# EAGLE design emonTx V3.2 (EAGLE 6.5.0)
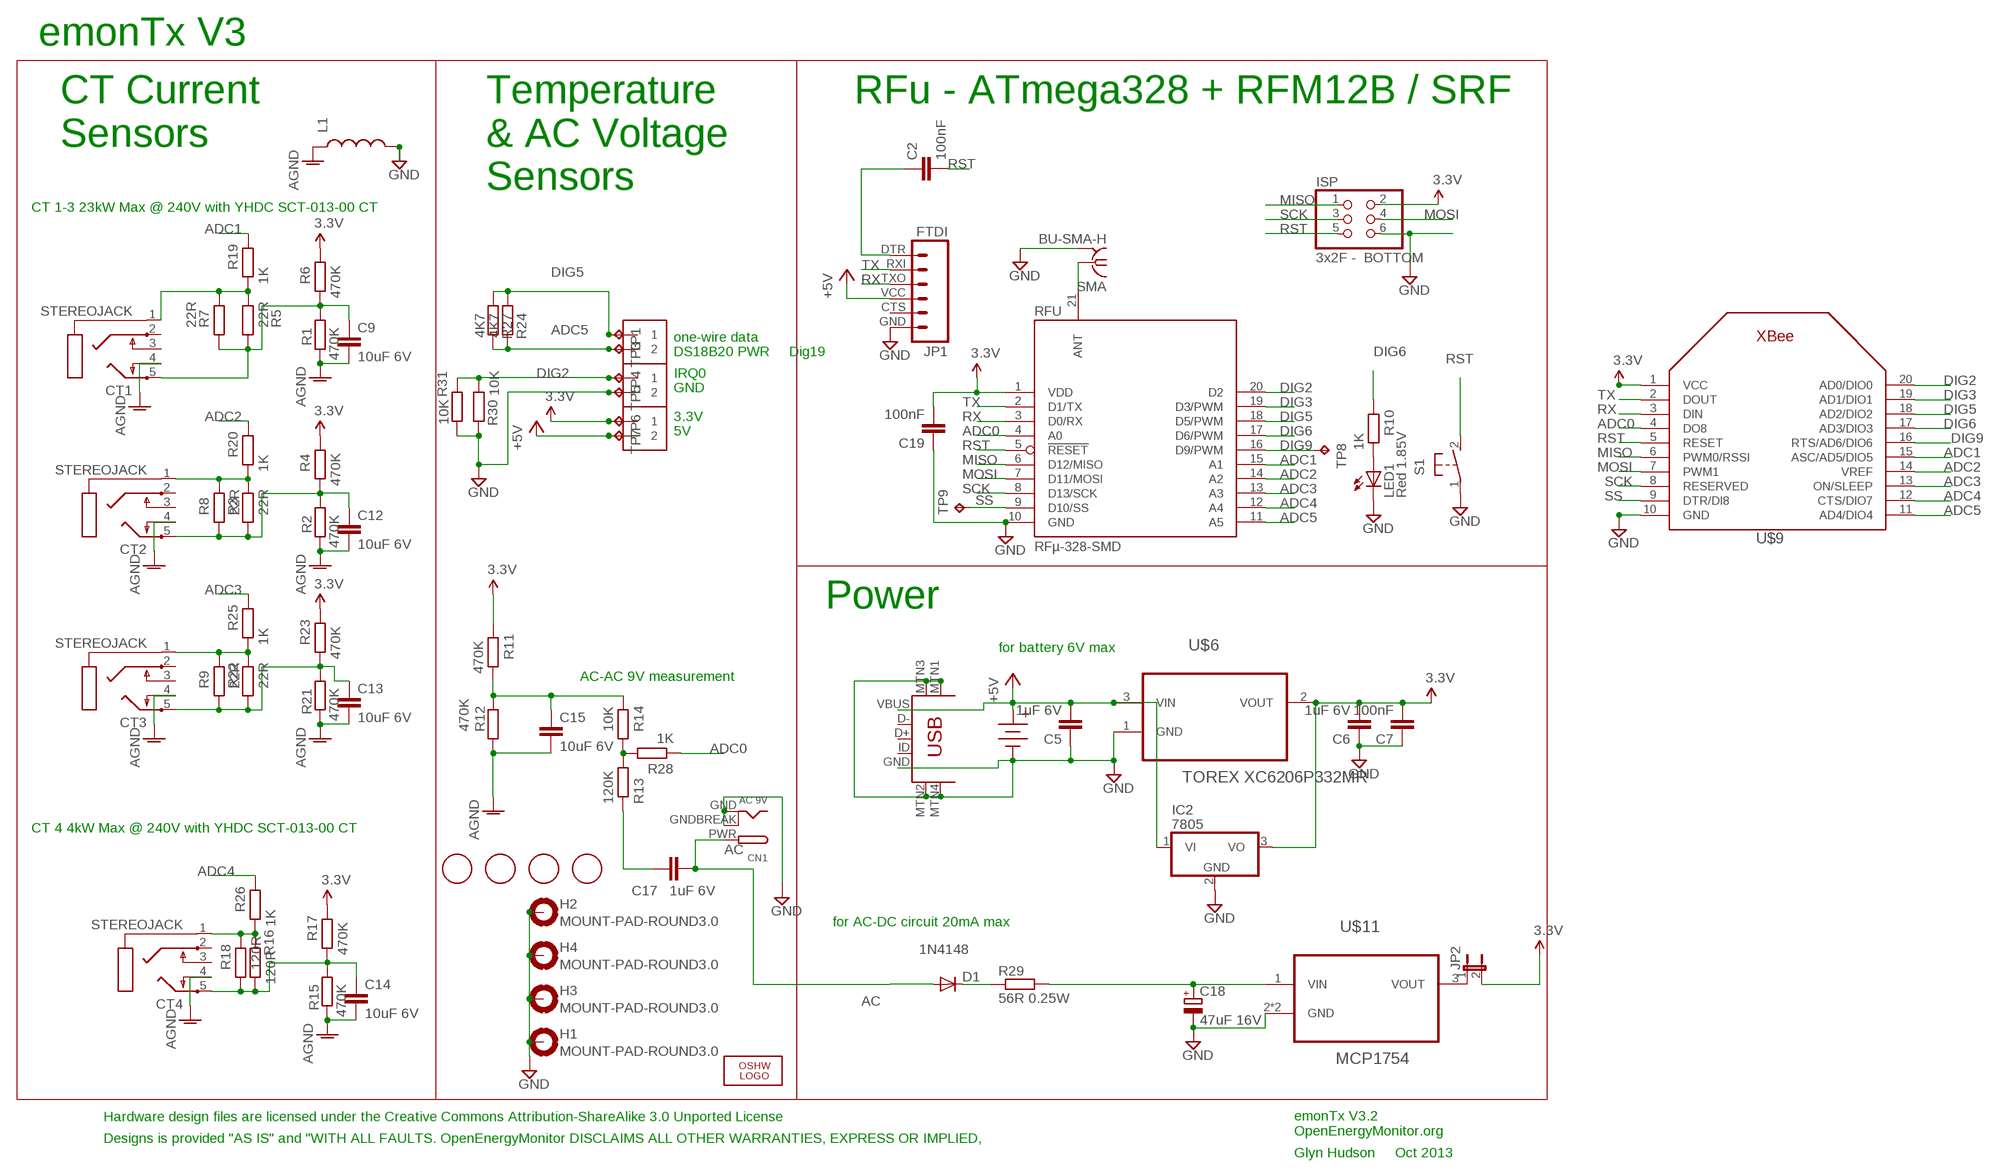
[diagram p0: schematic, sheet 1]

## Parts
C2  100nF  C-EUC0603  [C0603]
C5  1uF 6V  C-EUC0603  [C0603]
C6  1uF 6V  C-EUC0603  [C0603]
C7  100nF  C-EUC0603  [C0603]
C9  10uF 6V  C-EUC0603  [C0603]
C12  10uF 6V  C-EUC0603  [C0603]
C13  10uF 6V  C-EUC0603  [C0603]
C14  10uF 6V  C-EUC0603  [C0603]
C15  10uF 6V  C-EUC0603  [C0603]
C17  1uF 6V  C-EUC0603  [C0603]
C18  47uF 16V  CPOL-EUD  [PANASONIC_D]
C19  100nF  C-EUC0603  [C0603]
CN1  AC 9V  DCBARRELPTH  [DCJACK_2MM_PTH]
CT1  STEREOJACK  [STX3100]
CT2  STEREOJACK  [STX3100]
CT3  STEREOJACK  [STX3100]
CT4  STEREOJACK  [STX3100]
D1  1N4148  DIODESOD  [SOD-323]
H1  MOUNT-PAD-ROUND3.0  [3,0-PAD]
H2  MOUNT-PAD-ROUND3.0  [3,0-PAD]
H3  MOUNT-PAD-ROUND3.0  [3,0-PAD]
H4  MOUNT-PAD-ROUND3.0  [3,0-PAD]
IC2  7805  7812TV  [TO220V]
ISP  3x2F - BOTTOM  PINHD-2X3  [2X03]
J1  1X2-3.5MM  [1X2-3.5MM]
J2  1X2-3.5MM  [1X2-3.5MM]
J4  1X2-3.5MM  [1X2-3.5MM]
JP1  FTDI  FTDI_BASICPTH  [FTDI_BASIC]
JP2  JUMPER-2PTH_LOCK  [1X02_LOCK]
L1  INDUCTOR0603  [0603]
LED1  Red 1.85V  LEDCHIP-LED0805  [CHIP-LED0805]
LOGO1  OSHW_LOGO_6MILX0200-NT  [OSHW_6X200_NOTEXT]
R1  470K  R-EU_R0603  [R0603]
R2  470K  R-EU_R0603  [R0603]
R3  22R  R-EU_0204/7  [0204/7]
R4  470K  R-EU_R0603  [R0603]
R5  22R  R-EU_0204/7  [0204/7]
R6  470K  R-EU_R0603  [R0603]
R7  22R  R-EU_R1206  [R1206]
R8  22R  R-EU_R1206  [R1206]
R9  22R  R-EU_R1206  [R1206]
R10  1K  R-EU_R0603  [R0603]
R11  470K  R-EU_R0603  [R0603]
R12  470K  R-EU_R0603  [R0603]
R13  120K  R-EU_R0603  [R0603]
R14  10K  R-EU_R0603  [R0603]
R15  470K  R-EU_R0603  [R0603]
R16  120R  R-EU_0204/7  [0204/7]
R17  470K  R-EU_R0603  [R0603]
R18  120R  R-EU_R1206  [R1206]
R19  1K  R-EU_R0603  [R0603]
R20  1K  R-EU_R0603  [R0603]
R21  470K  R-EU_R0603  [R0603]
R22  22R  R-EU_0204/7  [0204/7]
R23  470K  R-EU_R0603  [R0603]
R24  4K7  R-EU_0204/7  [0204/7]
R25  1K  R-EU_R0603  [R0603]
R26  1K  R-EU_R0603  [R0603]
R27  4K7  R-EU_R0603  [R0603]
R28  1K  R-EU_R0603  [R0603]
R29  56R 0.25W  R-EU_R1206  [R1206]
R30  10K  R-EU_0204/7  [0204/7]
R31  10K  R-EU_R0603  [R0603]
RFU  RFµ-328-SMD  [RFµ-328-LANDING]
S1  31-XX  [B3F-31XX]
SMA  BU-SMA-H  [BU-SMA-H]
TP1  TPPAD1-13  [P1-13]
TP3  TPPAD1-13  [P1-13]
TP4  TPPAD1-13  [P1-13]
TP5  TPPAD1-13  [P1-13]
TP6  TPPAD1-13  [P1-13]
TP7  TPPAD1-13  [P1-13]
TP8  TPPAD1-13  [P1-13]
TP9  TPPAD1-13  [P1-13]
U$1  FIDUCIAL  [FIDUCIAL_1MM]
U$3  4.5V  3X_AAA_BATTERY_HOLDER  [AAA_PCB_HOLDER]
U$4  FIDUCIAL  [FIDUCIAL_1MM]
U$5  FIDUCIAL  [FIDUCIAL_1MM]
U$6  TOREX XC6206P332MR  MCP1700T-3302E/TT  [SOT95P237X112-3N]
U$7  FIDUCIAL  [FIDUCIAL_1MM]
U$9  XBEE  [XBEE]
U$10  USB-MINIB-5PIN  [USB-MINIB-CISECO]
U$11  MCP1754  [SOT89]

## Nets
3.3V: C6.2 C7.2 C19.2 IC2.3(VO) ISP.2 J4.1 JP2.2 R4.2 R6.2 R11.2 R17.2 R23.2 RFU.1(VDD) TP6.TP U$6.2(VOUT) U$9.1(VCC)
+5V [power]: C5.2 IC2.1(VI) J4.2 JP1.VCC TP7.TP U$3.+ U$6.3(VIN) U$10.VBUS
AC: C17.2 CN1.PWR D1.2(A)
ADC0: R28.1 RFU.4(A0) U$9.4(DO8)
ADC1: R19.2 RFU.15(A1) U$9.15(ASC/AD5/DIO5)
ADC2: R20.2 RFU.14(A2) U$9.14(VREF)
ADC3: R25.2 RFU.13(A3) U$9.13(ON/SLEEP)
ADC4: R26.2 RFU.12(A4) U$9.12(CTS/DIO7)
ADC5: J2.2 R24.2 R27.2 RFU.11(A5) TP3.TP U$9.11(AD4/DIO4)
AGND [gnd]: C9.2 C12.2 C13.2 C14.2 C15.2 CT1.4 CT2.4 CT3.4 CT4.4 L1.1 R1.2 R2.2 R12.1 R15.2 R21.2
DIG2: J1.1 R30.1 R31.1 RFU.20(D2) TP4.TP U$9.20(AD0/DIO0)
DIG3: RFU.19(D3/PWM) U$9.19(AD1/DIO1)
DIG5: J2.1 R24.1 R27.1 RFU.18(D5/PWM) TP1.TP U$9.18(AD2/DIO2)
DIG6: R10.2 RFU.17(D6/PWM) U$9.17(AD3/DIO3)
DIG9: RFU.16(D9/PWM) TP8.TP U$9.16(RTS/AD6/DIO6)
GND [gnd]: C5.1 C6.1 C7.1 C18.- C19.1 CN1.GND CN1.GNDBREAK H1.B3,0(MOUNT) H2.B3,0(MOUNT) H3.B3,0(MOUNT) H4.B3,0(MOUNT) IC2.2(GND) ISP.6 J1.2 JP1.GND L1.2 LED1.C R30.2 R31.2 RFU.10(GND) S1.1(P) SMA.2 SMA.3 SMA.4 SMA.5 TP5.TP U$3.- U$6.1(GND) U$9.10(GND) U$10.GND U$10.MTN1(MTN2) U$10.MTN2(MTN3) U$10.MTN3(MTN1) U$10.MTN4 U$11.2(GND) U$11.2.1(GND)
MISO: ISP.1 RFU.6(D12/MISO) U$9.6(PWM0/RSSI)
MOSI: ISP.4 RFU.7(D11/MOSI) U$9.7(PWM1)
N$2: CT1.1 R5.2 R7.2 R19.1
N$3: C13.1 CT3.5 R9.1 R21.1 R22.1 R23.1
N$4: R13.2 R14.1 R28.2
N$5: JP2.1 U$11.3(VOUT)
N$6: C18.+ R29.2 U$11.1(VIN)
N$7: C17.1 R13.1
N$8: CT4.1 R16.2 R18.2 R26.1
N$9: C2.1 JP1.DTR
N$10: CT2.1 R3.2 R8.2 R20.1
N$11: RFU.21(ANT) SMA.1
N$12: D1.1(C) R29.1
N$13: CT3.1 R9.2 R22.2 R25.1
N$33: C12.1 CT2.5 R2.1 R3.1 R4.1 R8.1
N$34: C15.1 R11.1 R12.2 R14.2
N$37: C14.1 CT4.5 R15.1 R16.1 R17.1 R18.1
N$38: C9.1 CT1.5 R1.1 R5.1 R6.1 R7.1
N$41: LED1.A R10.1
RST: C2.2 ISP.5 RFU.5(!RESET) S1.2(S) U$9.5(RESET)
RX: JP1.TXO RFU.3(D0/RX) U$9.3(DIN)
SCK: ISP.3 RFU.8(D13/SCK) U$9.8(RESERVED)
SS: RFU.9(D10/SS) TP9.TP U$9.9(DTR/DI8)
TX: JP1.RXI RFU.2(D1/TX) U$9.2(DOUT)
Unconnected: CT1.2 CT1.3 CT2.2 CT2.3 CT3.2 CT3.3 CT4.2 CT4.3 JP1.CTS U$10.D+ U$10.D- U$10.ID

## Notes on the sheet
- emonTx V3
- RFu - ATmega328 + RFM12B / SRF
- CT Current 
  Sensors
- Temperature 
  & AC Voltage
  Sensors
- CT 1-3 23kW Max @ 240V with YHDC SCT-013-00 CT
- one-wire data
- DS18B20 PWR | Dig19
- IRQ0
- GND
- 3.3V
- 5V
- Power
- for battery 6V max
- AC-AC 9V measurement
- CT 4 4kW Max @ 240V with YHDC SCT-013-00 CT
- for AC-DC circuit 20mA max
- Hardware design files are licensed under the Creative Commons Attribution-ShareAlike 3.0 Unported License
- emonTx V3.2
  OpenEnergyMonitor.org
- Designs is provided "AS IS" and "WITH ALL FAULTS. OpenEnergyMonitor DISCLAIMS ALL OTHER WARRANTIES, EXPRESS OR IMPLIED,
- Glyn Hudson     Oct 2013

## Library data of the parts
C2 C5-C7 C9 C12-C15 C17 C19 = resistor:C-EU: CAPACITOR, European symbol
C18 = resistor:CPOL-EU: POLARIZED CAPACITOR, European symbol
CN1 = adafruit:DCBARREL: 2.0mm DC Barrel Jack DCJACK_2MM_PTH - Through Hole Jack (4UConnector: 05537)
CT1-CT4 = adafruit:STEREOJACK: MIC/HEADPHONE JACK Stereo jack with two switches. Kycon STX3100, CUI SJ1-3555NG and/or 4UCon 05544
D1 = SparkFun:DIODE: Diode These are standard reverse protection diodes and small signal diodes. SMA package can handle up to about 1A. SOD-323 can handle about 200mA. What the SOD-323 package when ordering, there are some mfgs out there that are 5-pin packages.
H1-H4 = holes:MOUNT-PAD-ROUND: MOUNTING PAD, round
IC2 = linear:78*: Positive VOLTAGE REGULATOR Source: http://cache.national.com/ds/LM/LM78L05.pdf http://www.fairchildsemi.com/ds/LM/LM7805.pdf
ISP = pinhead:PINHD-2X3: PIN HEADER
J1 J2 J4 = adafruit:1X2: 3.5mm Terminal block http://www.ladyada.net/library/pcb/eaglelibrary.html
JP1 = SparkFun:FTDI_BASIC: FTDI Basic: 3.3V and 5V
JP2 = SparkFun:JUMPER-2: Jumper Basic 0.1" spaced jumper. Use with breakaway headers.
L1 = SparkFun:INDUCTOR: Inductors Basic Inductor/Choke - 0603 and 1206. Footprints are not proven and vary greatly between part numbers.
LED1 = adafruit:LED: LED OSRAM: - CHIPLED LG R971, LG N971, LY N971, LG Q971, LY Q971, LO R971, LY R971 LH N974, LH R974 LS Q976, LO Q976, LY Q976 LO Q996 - Hyper CHIPLED LW Q18S LB Q993, LB Q99A, LB R99A - SideLED LS A670, LO A670, LY A670, LG A670, LP A670 LB A673, LV A673, LT A673, LW A673 LH A674 LY A675 LS A676, LA A676, LO A676, LY A676, LW A676 LS A679, LY A679, LG A679 - Hyper Micro SIDELED® LS Y876, LA Y876, LO Y876, LY Y876 LT Y87S - SmartLED LW L88C, LW L88S LB L89C, LB L89S, LG L890 LS L89K, LO L89K, LY L89K LS L896, LA L896, LO L896, LY L896 - TOPLED LS T670, LO T670, LY T670, LG T670, LP T670 LSG T670, LSP T670, LSY T670, LOP T670, LYG T670 LG T671, LOG T671, LSG T671 LB T673, LV T673, LT T673, LW T673 LH T674 LS T676, LA T676, LO T676, LY T676, LB T676, LH T676, LSB T676, LW T676 LB T67C, LV T67C, LT T67C, LS T67K, LO T67K, LY T67K, LW E67C LS E67B, LA E67B, LO E67B, LY E67B, LB E67C, LV E67C, LT E67C LW T67C LS T679, LY T679, LG T679 LS T770, LO T770, LY T770, LG T770, LP T770 LB T773, LV T773, LT T773, LW T773 LH T774 LS E675, LA E675, LY E675, LS T675 LS T776, LA T776, LO T776, LY T776, LB T776 LHGB T686 LT T68C, LB T68C - Hyper Mini TOPLED® LB M676 - Mini TOPLED Santana® LG M470 LS M47K, LO M47K, LY M47K Source: http://www.osram.convergy.de/
LOGO1 = ohw-logo:OSHW_LOGO_6MIL
R1-R28 R30 R31 = rcl:R-EU_: RESISTOR, European symbol
R29 = resistor:R-EU_: RESISTOR, European symbol
RFU = Ciseco Footprints:RFµ-328-SMD
S1 = adafruit:31-XX: OMRON SWITCH Now with beefier pads!
SMA = con-coax:BU-SMA-H: FEMALE SMA CONNECTOR Radiall; OC_FARNELL: unknown; OC_NEWARK: unknown
TP1 TP3-TP9 = testpad:TP: Test pad
U$1 U$4 U$5 U$7 = adafruit:FIDUCIAL: For use by pick and place machines to calibrate the vision/machine, 1mm By microbuilder.eu
U$3 = Battery Holders:3X_AAA_BATTERY_HOLDER: 3x AA Battery Holder; RAPID_OC: 18-2967
U$6 = Farnell_MCP1700-SOT23:MCP1700T-3302E/TT: Low Quiescent Current LDO; MPN: MCP1700T-3302E/TT; OC_FARNELL: 1296592; OC_NEWARK: 88H9817; PACKAGE: SOT23-3; SUPPLIER: Microchip
U$9 = adafruit:XBEE
U$10 = Ciseco USB miniB:USB-MINIB: Mini-USB "B" connector with 5th pin broken out. Created new symbol breaking out 5th "ID" pin in mini/micro USB connector spec. See: http://en.wikipedia.org/wiki/Mini_usb#Cables. Uses same footprint as 4-pin symbol. Also added pins to connect to mounting / shield pads if required (probably not generally needed as signals aren't shielded once they leave the connector). Modified by Ciseco for Rapid Part 24-0357
U$11 = OpenEnergyMonitor:MCP1754

## Net classes
0 default: width 0.203 mm, drill 0.6 mm, clearance 0.203 mm
1 power: width 0.305 mm, drill 0.6 mm, clearance 0.254 mm
2 gnd: width 0.254 mm, drill 0.6 mm, clearance 0.254 mm

## Board
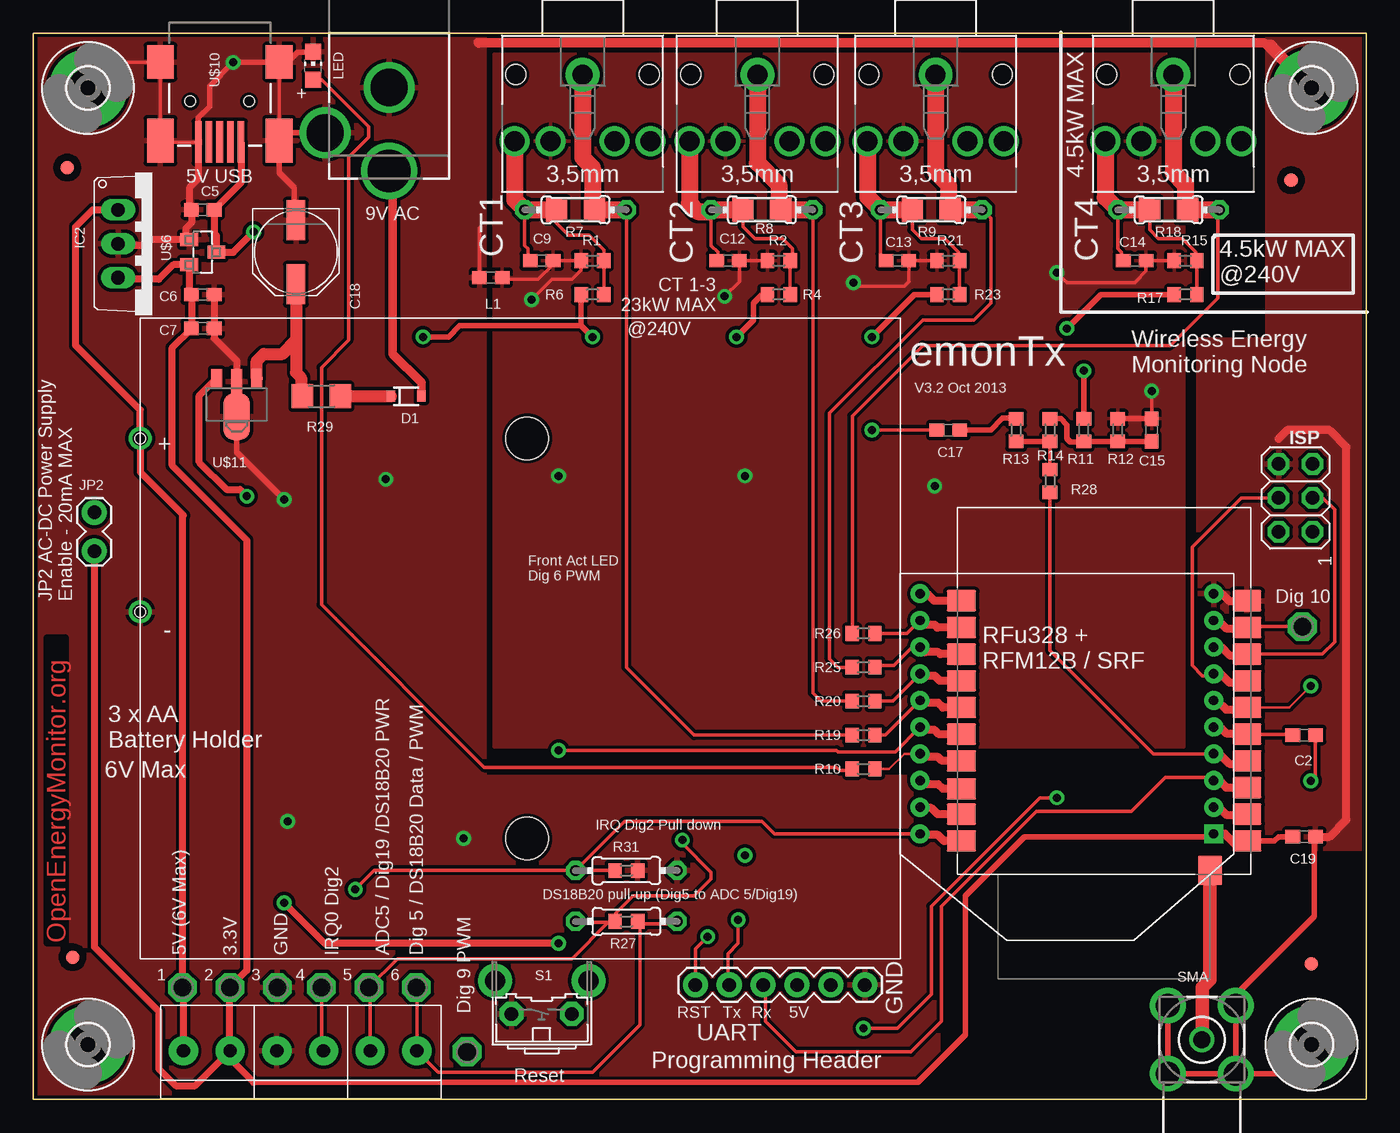
[diagram p1: board, top side]
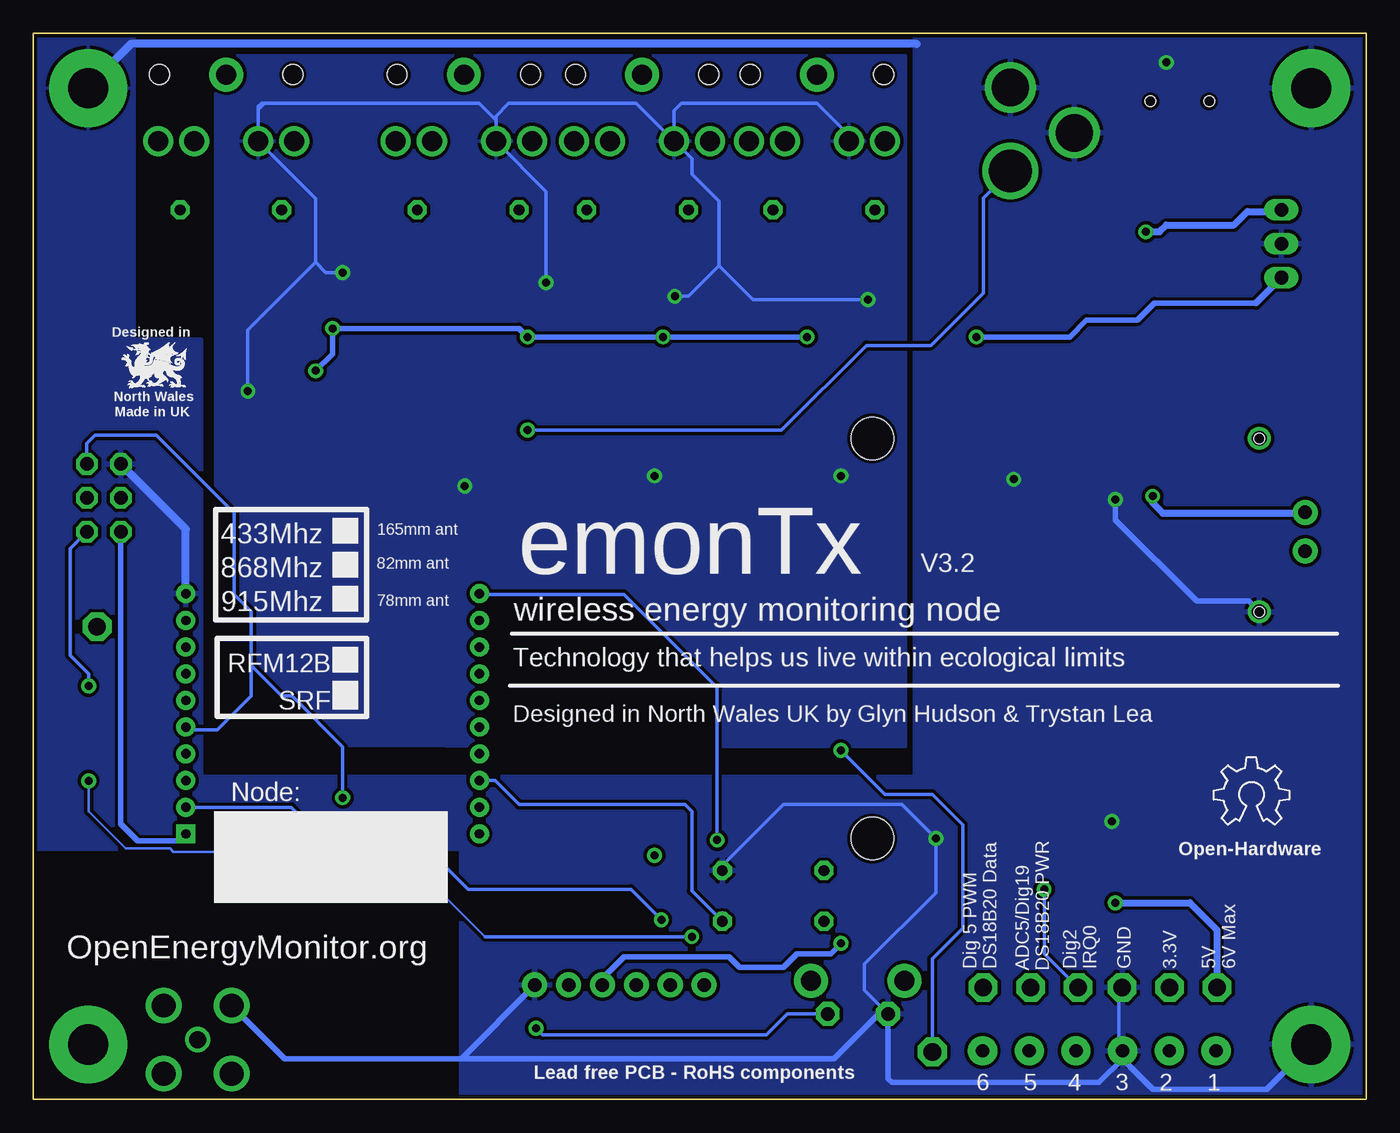
[diagram p2: board, bottom side, seen from below]

Size 99.9 x 79.9 mm. Coordinates in mm from the lower left corner, seen from the top.
Outline: 0,79.9 0,0 99.9,0 99.9,79.9 0,79.9
Copper layers (1*16): Top 0.035mm / dielectric 1.5mm / Bottom 0.035mm
Design rules "default *": minimum track width 8mil, minimum drill 0.6mm, track to track 8mil, track to pad 8mil, pad to pad 8mil, via to via 10mil, smd to smd 7mil, copper to edge 10mil, drill to drill 16mil, minimum pad ring 12mil, minimum via ring 10mil, stop-mask expansion 0.075mm, vias tented up to drill 0.6mm, thermal gap 10mil

### Footprints (pad centres in the part's own frame; a part is rotated, then mirrored left to right if it is on the bottom)
C0603 = smd 1.1 x 1: 1 -0.85,0; 2 0.85,0
PANASONIC_D = smd 3 x 1.4: + 2.4,0; - -2.4,0
DCJACK_2MM_PTH = drill 2.8: GND 0,7.35; GNDBREAK 4.8,10.75 | drill 3.2: PWR 0,13.6
STX3100 = drill 1.5 pad 2.54: 1 2.7,-0.1 | drill 1.5: 2 7.7,5; 3 7.7,2.3; 4 7.7,-2.5; 5 7.7,-5.2 | hole 1.5: 2.7,4.9; 2.7,-5.1
SOD-323 = smd 0.63 x 0.83: 1 -1.15,0; 2 1.15,0
3,0-PAD = drill 3 pad 5.842: B3,0 0,0
TO220V = drill 1.016 long: 1 -2.54,-2.54; 2 0,-2.54; 3 2.54,-2.54
2X03 = drill 1.016 octagon: 1 -2.54,-1.27; 2 -2.54,1.27; 3 0,-1.27; 4 0,1.27; 5 2.54,-1.27; 6 2.54,1.27
1X2-3.5MM = drill 1 pad 2.184: 1 1.8,0; 2 -1.7,0
FTDI_BASIC = drill 1.016 pad 1.88: CTS 10.16,0; DTR 0,0; GND 12.7,0; RXI 2.54,0; TXO 5.08,0; VCC 7.62,0
1X02_LOCK = drill 1.016 pad 1.88: 1 -0.178,0; 2 2.718,0
0603 = smd 1.1 x 1: 1 -0.85,0; 2 0.85,0
CHIP-LED0805 = smd 1.2 x 1.2: A 0,-1.05; C 0,1.05
R0603 = smd 1 x 1.1: 1 -0.85,0; 2 0.85,0
0204/7 = drill 0.813 octagon: 1 -3.81,0; 2 3.81,0
R1206 = smd 1.6 x 1.803: 1 -1.422,0; 2 1.422,0
RFµ-328-LANDING = smd 2.2 x 1.6: 1 -10.7,20; 2 -10.7,18; 3 -10.7,16; 4 -10.7,14; 5 -10.7,12; 6 -10.7,10; 7 -10.7,8; 8 -10.7,6; 9 -10.7,4; 10 -10.7,2; 11 10.7,2; 12 10.7,4; 13 10.7,6; 14 10.7,8; 15 10.7,10; 16 10.7,12; 17 10.7,14; 18 10.7,16.1; 19 10.7,18; 20 10.7,20 | smd 1.8 x 2.2: 21 -7.93,22.2
B3F-31XX = drill 1.016 pad 1.778 octagon: 1 -2.261,-1.245; 2 2.261,-1.245 | drill 1.499 pad 2.54: 3 -3.505,1.245; 4 3.505,1.245
BU-SMA-H = drill 1.27: 1 0,0 | drill 1.778: 2 -2.55,2.55; 3 2.55,2.55; 4 2.55,-2.55; 5 -2.55,-2.55
P1-13 = drill 1.321 pad 2.159 octagon: TP 0,0
FIDUCIAL_1MM = smd 1 x 1: 1 0,0
AAA_PCB_HOLDER = drill 1.1: + 29,-15; - 29,-2 | hole 0.8: 29,-15; 29,-2 | hole 3.2: 0,15; 0,-15
SOT95P237X112-3N = smd 0.991 x 1.321: 1 -0.94,-1.016; 2 0.94,-1.016; 3 0,1.016
XBEE = drill 0.7 pad 1.422 square: 1 -11,5.5 | drill 0.7 pad 1.422: 2 -11,3.5; 3 -11,1.5; 4 -11,-0.5; 5 -11,-2.5; 6 -11,-4.5; 7 -11,-6.5; 8 -11,-8.5; 9 -11,-10.5; 10 -11,-12.5; 11 11,-12.5; 12 11,-10.5; 13 11,-8.5; 14 11,-6.5; 15 11,-4.5; 16 11,-2.5; 17 11,-0.5; 18 11,1.5; 19 11,3.5; 20 11,5.5
USB-MINIB-CISECO = smd 3.1 x 0.5: D+ 8.25,0; D- 8.25,0.8; GND 8.25,-1.6; ID 8.25,-0.8; VBUS 8.25,1.6 | smd 2.5 x 2: MTN1 2.25,4.45; MTN3 2.25,-4.45 | smd 3.3 x 2: MTN2 8.15,4.45; MTN4 8.15,-4.45 | hole 0.8: 5.2,2.2; 5.2,-2.2
SOT89 = smd 0.8 x 1.4: 1 -1.499,-1.981; 3 1.499,-1.981 | smd 0.8 x 1.9: 2 0,-1.727 | smd 2 x 3.5: 2.1 0,0.889

### Placement (x,y rotation side)
C2  95.25,27.3 180 top
C5  12.7,66.67 0 top
C6  12.7,60.32 180 top
C7  12.7,57.78 180 top
C9  38.1,62.86 0 top
C12  52.07,62.86 0 top
C13  64.77,62.86 0 top
C14  82.55,62.86 0 top
C15  83.82,50.16 90 top
C17  68.58,50.16 180 top
C18  19.68,63.49 270 top
C19  95.25,19.68 180 top
CN1  26.67,83.19 180 top
CT1  41.27,79.51 270 top
CT2  54.37,79.51 270 top
CT3  67.73,79.51 270 top
CT4  85.54,79.51 270 top
D1  27.94,52.7 0 top
H1  4.1,75.8 0 top
H2  95.8,75.8 0 top
H3  4.1,4.1 0 top
H4  95.8,4.1 0 top
IC2  8.89,64.13 270 top
ISP  94.61,45.08 90 top
J1  19.95,3.63 0 top
J2  26.95,3.63 0 top
J4  12.95,3.63 0 top
JP1  49.62,8.57 0 top
JP2  4.57,43.81 270 top
L1  34.29,61.59 180 top
LED1  20.95,77.46 0 top
LOGO1  11.43,20.57 0 bottom
R1  41.91,62.86 180 top
R2  55.88,62.86 180 top
R3  54.61,66.67 0 top
R4  55.88,60.32 180 top
R5  40.64,66.67 0 top
R6  41.91,60.32 180 top
R7  40.64,66.67 0 top
R8  54.61,66.67 0 top
R9  67.31,66.67 0 top
R10  62.23,24.76 0 top
R11  78.74,50.16 90 top
R12  81.28,50.16 270 top
R13  73.66,50.16 270 top
R14  76.2,50.16 90 top
R15  86.36,62.86 180 top
R16  85.09,66.67 0 top
R17  86.36,60.32 180 top
R18  85.09,66.67 0 top
R19  62.23,27.3 0 top
R20  62.23,29.84 0 top
R21  68.58,62.86 180 top
R22  67.31,66.67 0 top
R23  68.58,60.32 180 top
R24  44.45,13.33 180 top
R25  62.23,32.38 0 top
R26  62.23,34.92 0 top
R27  44.45,13.33 180 top
R28  76.2,46.35 90 top
R29  21.59,52.7 180 top
R30  44.45,17.14 0 top
R31  44.45,17.14 0 top
RFU  80.26,39.36 180 top
S1  38.1,7.64 0 top
SMA  87.58,4.46 270 top
TP1  28.7,8.38 0 top
TP3  25.15,8.38 0 top
TP4  21.59,8.38 0 top
TP5  18.29,8.38 0 top
TP6  14.73,8.38 0 top
TP7  11.18,8.38 0 top
TP8  32.51,3.55 0 top
TP9  95.12,35.43 0 top
U$1  95.79,10.15 0 top
U$3  37.01,34.54 180 top
U$4  2.94,10.65 0 top
U$5  94.27,68.9 0 top
U$6  12.7,63.49 270 top
U$7  2.54,69.84 0 top
U$9  77.47,25.39 180 top
U$10  13.97,80 270 top
U$11  15.24,52.06 180 top

### Tracks (layer width: path | path; a pad name or v marks a point on that pad's centre or on a via)
3.3V  (via drill 0.6)
  Top 0.406: 90.17,19.04 90.64,19.04 RFU.1 93.03,19.36 93.34,19.68 C19.2 | R6.2 41.06,57.99 | 41.06,57.99 v41.91,57.14 | v52.7,57.14 53.98,58.41 53.98,59.68 54.61,60.32 R4.2 | R23.2 66.04,60.32 v62.87,57.14 | R17.2 80.01,60.32 v77.47,57.78 | 6.48,61.46 IC2.3 | 11.68,60.49 C6.2 | v78.74,54.6 R11.2 | J4.1 14.75,3.02 | 16.51,1.26 66.29,1.26 69.85,4.82 69.85,15.23 74.3,19.68 88.25,19.68 U$9.1 | 41.06,57.99 31.96,57.99 31.11,57.14 v29.21,57.14
  Top 0.508: 6.48,61.46 9.4,61.46 10.49,62.55 U$6.2 11.68,60.49 | C6.2 C7.2 10.41,56.34 10.41,47.49 16,41.9 16,9.65 TP6.TP 14.73,3.65 J4.1 12.13,1.01 10.67,1.01 9.4,2.28 9.4,6.6 4.57,11.42 JP2.2 | 14.75,3.02 16.51,1.26
  Top 0.61: 90.17,19.04 89.32,19.89 U$9.1
  Bottom 0.406: U$9.1 89,19.36 92.08,19.36 93.34,20.63 ISP.2 | v41.91,57.14 v52.7,57.14 v62.87,57.14 63.5,57.78 v77.47,57.78 77.47,55.87 v78.74,54.6 | v29.21,57.14 22.23,57.14 20.95,58.41 17.14,58.41 15.88,59.68 8.26,59.68
  Bottom 0.508: 8.26,59.68 IC2.3
+5V  (via drill 0.6)
  Top 0.406: IC2.1
  Top 0.508: U$10.VBUS 15.57,68.69 C5.2 13.55,64.93 13.72,64.76 U$6.3 14.99,63.49 v16.51,65.02 | IC2.1 4.45,66.67 3.17,65.4 3.17,56.51 8.01,51.67 U$3.+ 8.01,47 11.25,43.76 11.18,43.69 TP7.TP 11.25,8.3 | J4.2 11.25,8.3 | 11.25,8.3 11.25,8.7 | v39.37,11.68 21.84,11.68 v18.8,14.73
  Bottom 0.406: 6.48,66.54 IC2.1 | v39.37,11.68 40.13,10.92 42.67,10.92 43.69,9.9 46.99,9.9 47.75,10.66 55.63,10.66 57.24,9.05 JP1.VCC
  Bottom 0.508: v16.51,65.02 15.49,65.02 14.99,65.53 9.91,65.53 8.89,66.54 6.48,66.54 | v18.8,14.73 13.21,14.73 11.18,12.69 TP7.TP
AC  (via drill 0.6)
  Top 0.254: C17.2 v62.87,50.16
  Top 0.635: D1.2 29.09,53.71 26.92,55.87 26.92,69.34 CN1.PWR
  Bottom 0.254: v62.87,50.16 43.81,50.16 37.47,56.51 32.64,56.51 28.7,60.45 28.7,67.56 CN1.PWR
ADC0
  Top 0.254: R28.1 76.2,33.65 83.95,25.89 U$9.4
  Top 0.61: U$9.4 88.91,25.89 89.66,25.14 90.49,25.14 RFU.4
ADC1
  Top 0.254: 66.65,29.71 U$9.15 63.88,27.3 R19.2
  Top 0.61: RFU.15 68.17,29.36 67.82,29.71 66.65,29.71
ADC2
  Top 0.254: 66.62,31.74 U$9.14 64.42,29.84 R20.2
  Top 0.61: RFU.14 67.94,31.36 67.56,31.74 66.62,31.74
ADC3
  Top 0.254: 67.98,33.36 67.82,33.52 | U$9.13 65.9,33.89 64.52,32.51 63.2,32.51 R25.2
  Top 0.61: RFU.13 67.98,33.36 | 67.82,33.52 66.84,33.52 U$9.13
ADC4
  Top 0.254: R26.2 65.5,34.92 U$9.12
  Top 0.61: RFU.12 67.75,35.36 67.56,35.55 66.81,35.55 U$9.12
ADC5  (via drill 0.6)
  Top 0.254: 66.52,37.84 U$9.11 | v48.64,19.42 48.64,19.17 50.8,17.01 50.8,16.5 49.53,15.23 44.96,15.23 43.69,13.96 43.69,13.24 | 25.48,3.63 J2.2 25.25,8.27 TP3.TP 27.3,10.53 40.39,10.53 43.09,13.24 | 43.69,13.24 R27.2 | 43.09,13.24 40.73,13.24 R24.2 | 43.69,13.24 43.09,13.24
  Top 0.61: RFU.11 67.53,37.36 67.06,37.84 66.52,37.84
  Bottom 0.254: U$9.11 66.42,37.84 55.63,37.84 48.9,31.11 48.77,30.98 48.64,30.85 v48.64,19.42
AGND  (via drill 0.6)
  Top 0.254: C15.2 v83.82,53.08 | R15.2 C14.2 83.4,62.06 82.55,61.21 77.47,61.21 v76.71,61.97 | R2.2 C12.2 52.92,61.3 v51.82,60.19 | R21.2 C13.2 65.62,61.3 65.28,60.95 61.72,60.95 v61.47,61.21 | L1.1 35.27,61.46 37.85,61.46 38.95,62.57 C9.2 R1.2 41.06,62.14 40.39,61.46 38.86,61.46 v37.34,59.94
  Top 0.406: R12.1 C15.2
  Bottom 0.254: CT2.4 51.87,74.11 51.31,74.67 41.15,74.67 38.86,72.38 38.86,71.9 CT1.4 | 65.23,73.4 CT3.4 61.47,68.05 v61.47,61.21 | 65.23,73.4 65.23,73.7 64.26,74.67 54.72,74.67 CT2.4 | CT4.4 83.04,74.43 82.8,74.67 82.55,74.67 | 82.55,74.67 66.5,74.67 65.23,73.4 | CT4.4 83.04,74.18 82.55,74.67 | v51.82,60.19 50.8,60.19 48.51,62.48 | 48.51,62.48 48.51,67.3 50.55,69.34 50.55,70.49 CT2.4 | v83.82,53.08 83.82,57.65 78.74,62.73 | 78.74,62.73 78.74,67.51 CT4.4 | v76.71,61.97 77.98,61.97 78.74,62.73 | v37.34,59.94 45.97,59.94 48.51,62.48
  other vias: 53.34,46.73 39.37,46.73 67.56,45.97
  pour Top (isolate 0): 34.54,78.35 34.54,26.41 86.23,26.41 86.23,78.35
  pour Bottom (isolate 0): 34.54,26.41 86.23,26.54 86.23,78.23 34.54,78.23
  pour Top: 84.84,78.35 91.44,78.35 91.44,58.79 84.84,58.79
  pour Top: 84.07,78.35 91.31,78.35 91.31,58.79 84.07,58.79
DIG2  (via drill 0.6)
  Top 0.254: 66.56,19.81 U$9.20 55.54,19.89 54.61,20.82 44.32,20.82 R30.1 | R31.1 R30.1 | R30.1 25.53,17.14 v24.13,15.74 | TP4.TP 21.59,3.79 J1.1
  Top 0.61: RFU.20 68.26,19.36 67.82,19.81 66.56,19.81
  Bottom 0.254: v24.13,15.74 24.13,10.92 TP4.TP
DIG3
  Top 0.254: 66.53,21.84 U$9.19
  Top 0.61: RFU.19 67.78,21.36 67.31,21.84 66.53,21.84
DIG5
  Top 0.254: 45.47,13.16 45.47,5.58 41.91,2.03 30.36,2.03 J2.1 28.75,8.33 TP1.TP | 45.47,13.16 R27.1 | 45.47,13.16 48.09,13.16 R24.1
  Top 0.61: RFU.18 68.17,23.26 67.82,23.62 66.75,23.62 U$9.18
  Bottom 0.254: U$9.18 65.3,23.89 63.5,22.09 51.05,22.09 50.55,21.58 50.55,15.62 R24.1 48.26,13.96
DIG6
  Top 0.203: R10.2 64.14,24.76 65.28,25.9 U$9.17
  Top 0.254: 66.72,25.65 U$9.17
  Top 0.61: RFU.17 68.1,25.36 67.82,25.65 66.72,25.65
DIG9  (via drill 0.6)
  Top 0.254: 66.68,27.68 U$9.16 64.61,26.03 60.33,26.03 60.2,26.16 v39.37,26.16
  Top 0.61: RFU.16 67.88,27.36 67.56,27.68 66.68,27.68
  Bottom 0.254: v39.37,26.16 36.07,22.85 32.51,22.85 30.23,20.57 30.23,12.82 32.51,10.53 TP8.TP
GND  (via drill 0.6)
  Top 0.203: 96.01,19.59 C19.1 | 18.29,3.67 J1.2
  Top 0.254: 90.68,37.33 RFU.10 | U$10.MTN2 18.42,77.09 18.54,77.21 18.54,77.63 U$10.MTN1 | U$10.MTN4 U$10.MTN3 6.05,77.75 H1.B3,0 | U$10.MTN4 9.52,71.25 9.65,71.11 | 9.65,71.11 9.65,70.86 | 9.65,71.11 9.65,71.72 U$10.MTN4 | U$10.GND 9.62,71.75 U$10.MTN4 | L1.2 33.44,65.33 | U$11.2.1 15.24,50.29
  Top 0.305: 95.01,75.8 95.9,75.8
  Top 0.406: 11.68,66.84 C5.1 | 11.43,64.69 U$6.1 | 6.48,64 IC2.2 | 96.01,19.59 96.01,13.71 90.13,7.83 SMA.2 SMA.3 | SMA.3 93.61,1.91 H4.B3,0 | SMA.3 SMA.4 SMA.5 | 18.54,77.63 18.96,77.63 19.81,78.48 20.92,78.48 LED1.C | C18.- 19.56,66.02 19.56,68.32 18.42,69.46 U$10.MTN2 19.01,72.44 CN1.GNDBREAK | U$10.GND 12.37,73.58 13.21,74.42 13.21,75.94 v14.99,77.72 18.38,77.72 U$10.MTN1 | 15.24,50.29 15.24,48.51 v18.8,44.95
  Top 0.508: U$10.GND 12.37,69.01 11.68,68.32 11.68,66.84 | C5.1 11.85,65.69 11.43,65.27 11.43,64.69 | U$6.1 8.56,64.43 8.13,64 6.48,64 | C6.1 C7.1 13.55,57.06 15.24,55.37 U$11.2
  Top 0.61: U$9.10 89.1,37.89 89.66,37.33 90.68,37.33 | C19.1 97.16,19.68 98.42,20.95 98.42,48.89 97.16,50.16 93.98,50.16 93.34,49.52 | H2.B3,0 95.01,75.8 | 95.9,75.8 92.84,79.11 33.4,79.11 33.27,79.24 92.2,79.24 95.5,75.94 95.76,75.94
  Bottom 0.254: 18.54,9.14 18.54,3.92 J1.2 18.25,3.04 | 48.26,17.52 43.69,22.09 34.8,22.09 v32.26,19.55 32.26,15.49 37.59,10.15 37.59,8.15 S1.1
  Bottom 0.406: 67.82,3.04 39.88,3.04 36.52,6.4 S1.1 35.84,1.54 35.56,1.26 20.03,1.26 18.25,3.04 | 67.82,3.04 81.06,3.04 SMA.5 | J1.2 18.25,3 16,0.76 7.45,0.76 H3.B3,0 | JP1.GND 62.32,8.54 67.82,3.04 | R30.2 48.26,17.52 | v18.8,44.95 18.8,43.43 12.7,37.33 8.8,37.33 U$3.-
  Bottom 0.61: U$9.10 88.47,42.74 ISP.6 | 33.68,79.11 92.58,79.11 95.76,75.94
  other vias: 19.05,20.82 26.42,46.48
  pour Top (isolate 0): -0.76,80.77 33.78,80.77 33.78,24.12 87.38,24.12 87.38,56.89 100.08,56.89 100.33,18.79 67.82,18.79 67.82,-0.77 -0.76,-0.77
  pour Top: 92.46,80.13 92.46,56.89 100.08,56.89 100.08,80.13
  pour Bottom: 92.33,79.88 92.33,56.64 99.95,56.64 99.95,79.88
  pour Bottom (isolate 0): -0.76,80.77 33.78,80.77 33.78,24.12 87.38,24.12 87.38,56.89 100.08,56.89 100.33,18.79 67.82,18.79 67.82,-0.77 -0.76,-0.77
MISO  (via drill 0.6)
  Top 0.203: RFU.6 94.14,29.36 v95.76,30.98
  Top 0.254: 90.55,29.2 RFU.6
  Top 0.61: U$9.6 88.72,29.89 89.41,29.2 90.55,29.2
  Bottom 0.203: 95.76,42.41 ISP.1
  Bottom 0.254: v95.76,30.98 95.76,31.87 97.16,33.27 97.16,41.27 ISP.1
MOSI
  Top 0.254: ISP.4 92.58,45.08 90.55,45.08 86.87,41.4 86.87,32.51 87.63,31.74 88.32,31.74 U$9.7
  Top 0.61: U$9.7 89,31.89 89.66,31.24 90.58,31.24 RFU.7
N$2
  Top 0.254: R19.1 49.53,27.3 44.45,32.38 R5.2
  Top 1.27: R5.2 43.18,66.67 R7.2 41.91,66.82 41.91,69.84 41.17,70.58 CT1.1
N$3
  Top 0.254: R22.1 63.5,63.28 C13.1 | R9.1 65.89,65.17 66.55,64.51 68.33,64.51 69.34,63.49 69.34,62.95 R21.1 R23.1
  Top 1.27: CT3.5 62.53,67.64 R22.1 R9.1
N$4
  Top 0.254: R28.2 R14.1
  Top 0.406: R13.2 R14.1
N$5  (via drill 0.6)
  Top 0.508: U$11.3 12.45,52.75 12.45,47.75 14.48,45.71 15.49,45.71 v16,45.21
  Bottom 0.508: v16,45.21 16,44.7 15.24,43.94 4.62,43.94 JP2.1
N$6
  Top 0.889: C18.+ 19.68,56.89 | 19.68,56.89 19.68,54.48 20.07,54.1 20.07,52.8 | U$11.1 16.74,55.34 17.27,55.87 18.67,55.87 19.68,56.89
  Top 1.016: 20.07,52.8 R29.2
N$7
  Top 0.406: C17.1 71.76,50.16 72.64,51.05 73.62,51.05 R13.1
N$8
  Top 0.254: R26.1 61.38,51.21 66.67,56.51 85.22,56.51 88.77,60.06 88.77,66.54 R16.2
  Top 1.27: R16.2 R18.2 86.36,66.82 86.36,68.57 85.44,69.49 CT4.1
N$9  (via drill 0.6)
  Top 0.254: C2.1 96.1,24.21 v95.76,23.87 | JP1.DTR 49.62,11.26 v50.55,12.19
  Bottom 0.203: v95.76,23.87 95.76,21.58 92.96,18.79 89.66,18.79 89.41,18.54 72.39,18.54 66.04,12.19
  Bottom 0.254: v50.55,12.19 66.04,12.19
N$10
  Top 0.254: R20.1 59.05,29.84 58.42,30.47 R3.2
  Top 1.27: R3.2 57.15,66.67 R8.2 55.88,66.82 55.88,68.57 54.27,70.19 CT2.1
N$11
  Top 1.016: RFU.21 88.19,8.94 87.63,8.38 87.63,4.51 SMA.1
N$12
  Top 0.889: R29.1 D1.1
N$13
  Top 0.254: R25.1 60.32,32.38 59.69,33.01 59.69,51.43 66.67,58.41 70.48,58.41 71.75,59.68 71.75,66.04 R22.2
  Top 1.27: R22.2 R9.2 68.58,66.82 68.58,68.57 67.63,69.52 CT3.1
N$14  (via drill 0.6)
  other vias: 53.34,18.28
N$33
  Top 0.254: R3.1 50.8,64 51.31,63.49 51.31,62.95 C12.1 | R8.1 53.19,65.42 54.1,64.51 56.13,64.51 56.9,63.75 56.9,63.03 R2.1 R4.1
  Top 1.27: CT2.5 49.16,67.16 49.78,66.54 50.67,66.54 R3.1 R8.1
N$34
  Top 0.406: R14.2 77,51.01 77.47,50.54 77.47,49.52 77.72,49.27 78.7,49.27 R11.1 R12.2 C15.1
N$37
  Top 0.254: R16.1 81.28,63.75 81.53,63.49 81.53,63.03 C14.1 | R18.1 83.67,65.17 84.33,64.51 86.11,64.51 87.12,63.49 87.12,62.95 R15.1 R17.1
  Top 1.27: CT4.5 80.34,67.61 R16.1 R18.1
N$38
  Top 0.254: R5.1 36.83,64 37.08,63.75 37.08,63.03 C9.1 | R7.1 39.12,66.57 39.12,65.78 40.13,64.76 41.66,64.76 42.76,63.66 R1.1 R6.1
  Top 1.27: CT1.5 36.07,67.43 R5.1 R7.1
N$41
  Top 0.203: 61.47,24.67 R10.1
  Top 0.254: LED1.A 21.62,76.41 25.15,72.89 25.15,72.13 23.62,70.61 23.62,56.89 21.59,54.86 21.59,37.08 33.78,24.89 60.2,24.89 60.45,24.63 61.25,24.63 R10.1
RST  (via drill 0.6)
  Top 0.254: RFU.5 94.34,27.36 C2.2 | v62.23,5.33 64.77,5.33 67.31,7.87 67.31,14.47 75.44,22.6 v76.71,22.6
  Top 0.61: U$9.5 88.94,27.89 89.41,27.43 90.65,27.43 RFU.5
  Bottom 0.254: ISP.5 95.89,49.14 95.25,49.78 90.68,49.78 84.84,43.94 84.84,37.84 83.57,36.57 83.57,32.51 | 83.57,32.51 83.57,30.22 86.11,27.68 88.26,27.68 U$9.5 | S1.2 43.38,6.4 44.96,4.82 61.72,4.82 v62.23,5.33 | v76.71,22.6 76.71,26.41 80.52,30.22 81.28,30.22 83.57,32.51
RX
  Top 0.203: 88.47,24.05 88.39,24.12
  Top 0.254: 90.71,23.36 RFU.3 | U$9.3 88.47,24.05 | 88.39,24.12 84.84,24.12 82.3,21.58 75.18,21.58 68.07,14.47 68.07,5.84 65.79,3.55 57.15,3.55 54.86,5.84 54.86,8.41 JP1.TXO
  Top 0.61: U$9.3 88.88,23.89 89.41,23.36 90.71,23.36
SCK
  Top 0.203: 96.65,45.08 96.77,44.95
  Top 0.254: 90.61,33.27 RFU.8 96.62,33.36 97.54,34.28 97.54,44.19 96.77,44.95 | ISP.3 96.65,45.08
  Top 0.61: U$9.8 89.04,33.89 89.66,33.27 90.61,33.27
SS
  Top 0.254: 90.65,35.3 RFU.9 91.03,35.43 TP9.TP
  Top 0.61: U$9.9 88.81,35.89 89.41,35.3 90.65,35.3
TX  (via drill 0.6)
  Top 0.254: v52.83,13.46 52.83,11.68 52.07,10.92 52.07,8.66 JP1.RXI
  Top 0.61: U$9.2 88.84,21.89 89.41,21.33 90.68,21.33 RFU.2
  Bottom 0.254: U$9.2 80.57,21.89 79.5,20.82 72.39,20.82 67.31,15.74 55.12,15.74 v52.83,13.46

### Text on the board
Top: OpenEnergyMonitor.org
bPlace: Designed in | North Wales | Made in UK | 165mm ant | 433Mhz | 82mm ant | V3.2 | emonTx | 868Mhz | 78mm ant | 915Mhz | wireless energy monitoring node | Technology that helps us live within ecological limits | RFM12B | SRF | Designed in North Wales UK by Glyn Hudson & Trystan Lea | Node: | Open-Hardware | OpenEnergyMonitor.org | 5V / 6V Max | 3.3V | GND | Dig2 / IRQ0 | ADC5/Dig19 / DS18B20 PWR | Dig 5 PWM / DS18B20 Data | 1 | 2 | 3 | 4 | 5 | 6 | Lead free PCB - RoHS components
tSilk: LED | 5V USB | 4.5kW MAX | 9V AC | CT 1-3 / 23kW MAX | 4.5kW MAX / @240V | @240V | emonTx | Wireless Energy / Monitoring Node | V3.2 Oct 2013 | 1 | Front Act LED / Dig 6 PWM | JP2 AC-DC Power Supply / Enable - 20mA MAX | Dig 10 | RFu328 + / RFM12B / SRF | 3 x AA / Battery Holder | 6V Max | IRQ Dig2 Pull down | DS18B20 pull-up (Dig5 to ADC 5/Dig19) | Dig 9 PWM | 5V (6V Max) | 3.3V | GND | IRQ0 Dig2 | ADC5 / Dig19 /DS18B20 PWR | Dig 5 / DS18B20 Data / PWM | 1 | 2 | 3 | 4 | 5 | 6 | GND | RST | Tx | Rx | 5V | UART | Programming Header | Reset
_tsilk: Designed in | North Wales | Made in UK
_bsilk: SMT V0.6 rev3 | emonTx | wireless energy monitoring node | SMT V0.6 rev3 | emonTx | SMT V0.6 rev3 | emonTx | Technology that helps us live within ecological limits | wireless energy monitoring node | wireless energy monitoring node | Designed in North Wales UK by Glyn Hudson & Trystan Lea | Technology that helps us live within ecological limits | Technology that helps us live within ecological limits | Designed in North Wales UK by Glyn Hudson & Trystan Lea | 165mm ant | 433Mhz | Designed in North Wales UK by Glyn Hudson & Trystan Lea | 165mm ant | 165mm ant | 433Mhz | 433Mhz | 868Mhz | 82mm ant | 82mm ant | 82mm ant | 868Mhz | 868Mhz | 78mm ant | 915Mhz | 78mm ant | 915Mhz | 78mm ant | 915Mhz | 165mm ant | 433Mhz | 82mm ant | 868Mhz | 78mm ant | 915Mhz